# EAGLE design coprocessor (EAGLE 7.7.0)
CREVISION: 0.2; DESIGNER: Matthew Carlson

## Sheet 1 of 2
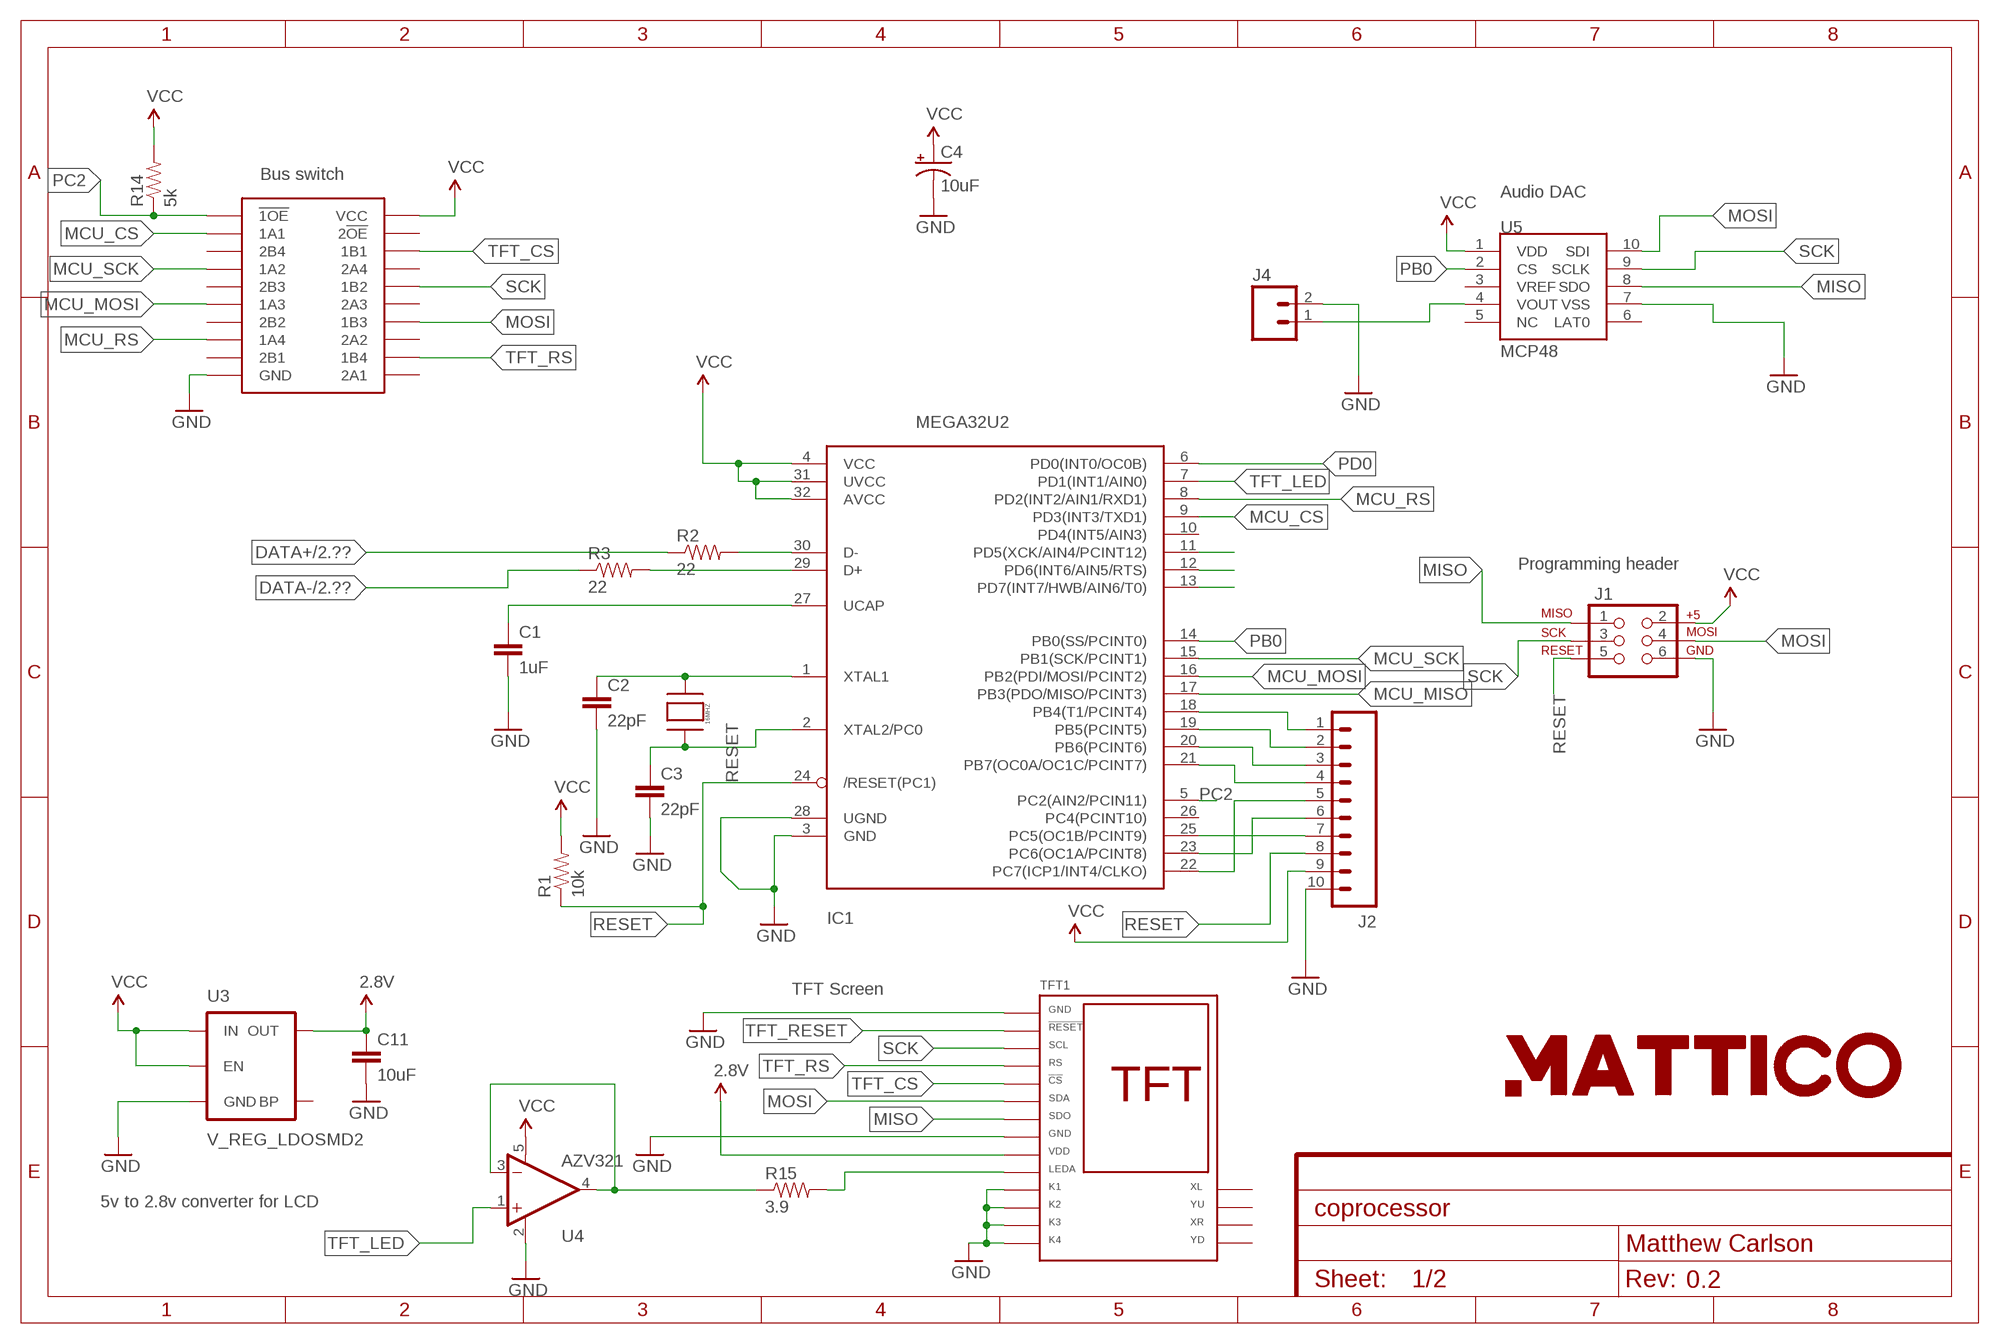
[diagram p0: schematic, sheet 1]

### Parts
C1  1uF  CAP0805  [0805]
C2  22pF  CAP0805  [0805]
C3  22pF  CAP0805  [0805]
C4  10uF  CAP_POL1206  [EIA3216]
C11  10uF  10UF10V10%(0805)  [0805-CAP]
IC1  MEGA32U2  ATMEGA32U2-TQFP  [TQFP32-08]
J1  AVR_SPI_PRG_6NS  [2X3-NS]
J2  M102MM  [1X10-2MM]
J4  M02LOCK  [1X02_LOCK]
R1  10k  RESISTOR0805-RES  [0805]
R2  22  RESISTOR0805-RES  [0805]
R3  22  RESISTOR0805-RES  [0805]
R14  5k  RESISTOR0805-RES  [0805]
R15  3.9  RESISTOR0805-RES  [0805]
TFT1  TFT-18-1.0MM  [TFT-CONN-18]
U3  V_REG_LDOSMD2  [SC70]
U4  AZV321  [SOT23-5]
U5  MCP48  MCP48FEB01-E/UN  [10-MSOP]
U6  16MHZ  CRYSTAL-ABLS  [HC49/US]
U7  CBT3244AD  [S020-75MM]
U$2  LOGO2INCH_SVG  [LOGO_2INCH_SVG]

### Nets
2.8V: C11.1 TFT1.9(VDD) U3.5(OUT)
DAC_VOUT: J4.1 U5.4(VOUT)
DATA+: R2.1 ; also sheet 2
DATA-: R3.1 ; also sheet 2
GND: C1.2 C2.2 C3.2 C4.C(-) C11.2 IC1.3(GND) IC1.28(UGND) J1.6 J2.10 J4.2 TFT1.1(GND) TFT1.8(GND) TFT1.11(K1) TFT1.12(K2) TFT1.13(K3) TFT1.14(K4) U3.2(GND) U4.2(V-) U5.7(VSS) U7.P$10(GND) ; also sheet 2
MCU_CS: IC1.9(PD3(INT3/TXD1)) U7.P$2(1A1)
MCU_MISO: IC1.17(PB3(PDO/MISO/PCINT3))
MCU_MOSI: IC1.16(PB2(PDI/MOSI/PCINT2)) U7.P$6(1A3)
MCU_RS: IC1.8(PD2(INT2/AIN1/RXD1)) U7.P$8(1A4)
MCU_SCK: IC1.15(PB1(SCK/PCINT1)) U7.P$4(1A2)
MISO: J1.1 TFT1.7(SDO) U5.8(SDO)
MOSI: J1.4 TFT1.6(SDA) U5.10(SDI) U7.P$14(1B3)
N$2: IC1.29(D+) R3.2
N$3: IC1.30(D-) R2.2
N$5: IC1.18(PB4(T1/PCINT4)) J2.1
N$7: C1.1 IC1.27(UCAP)
N$9: C2.1 IC1.1(XTAL1) U6.P$2
N$10: C3.1 IC1.2(XTAL2/PC0) U6.P$1
N$19: R15.2 TFT1.10(LEDA)
N$20: R15.1 U4.3(-IN) U4.4(OUT)
N$25: IC1.19(PB5(PCINT5)) J2.2
N$26: IC1.20(PB6(PCINT6)) J2.3
N$27: IC1.21(PB7(OC0A/OC1C/PCINT7)) J2.4
N$28: IC1.22(PC7(ICP1/INT4/CLKO)) J2.5
N$29: IC1.23(PC6(OC1A/PCINT8)) J2.6
N$30: IC1.25(PC5(OC1B/PCINT9)) J2.7
PB0: IC1.14(PB0(SS/PCINT0)) U5.2(CS)
PC2: IC1.5(PC2(AIN2/PCIN11)) R14.1 U7.P$1(!1OE)
PD0: IC1.6(PD0(INT0/OC0B))
PD5: IC1.11(PD5(XCK/AIN4/PCINT12))
PD6: IC1.12(PD6(INT6/AIN5/RTS))
PD7: IC1.13(PD7(INT7/HWB/AIN6/T0))
RESET: IC1.24(/RESET(PC1)) J1.5 J2.8 R1.1
SCK: J1.3 TFT1.3(SCL) U5.9(SCLK) U7.P$16(1B2)
TFT_CS: TFT1.5(!CS) U7.P$18(1B1)
TFT_LED: IC1.7(PD1(INT1/AIN0)) U4.1(+IN)
TFT_RESET: TFT1.2(!RESET)
TFT_RS: TFT1.4(RS) U7.P$12(1B4)
VCC: C4.A(+) IC1.4(VCC) IC1.31(UVCC) IC1.32(AVCC) J1.2 J2.9 R1.2 R14.2 U3.1(IN) U3.3(EN) U4.5(V+) U5.1(VDD) U7.P$20(VCC) ; also sheet 2
Unconnected: IC1.10(PD4(INT5/AIN3)) IC1.26(PC4(PCINT10)) TFT1.15(XL) TFT1.16(YU) TFT1.17(XR) TFT1.18(YD) U3.4(BP) U5.3(VREF) U5.5(NC) U5.6(LAT0) U7.P$3(2B4) U7.P$5(2B3) U7.P$7(2B2) U7.P$9(2B1) U7.P$11(2A1) U7.P$13(2A2) U7.P$15(2A3) U7.P$17(2A4) U7.P$19(2!OE)

### Notes on the sheet
- Bus switch
- Audio DAC
- Programming header
- TFT Screen
- 5v to 2.8v converter for LCD

## Sheet 2 of 2
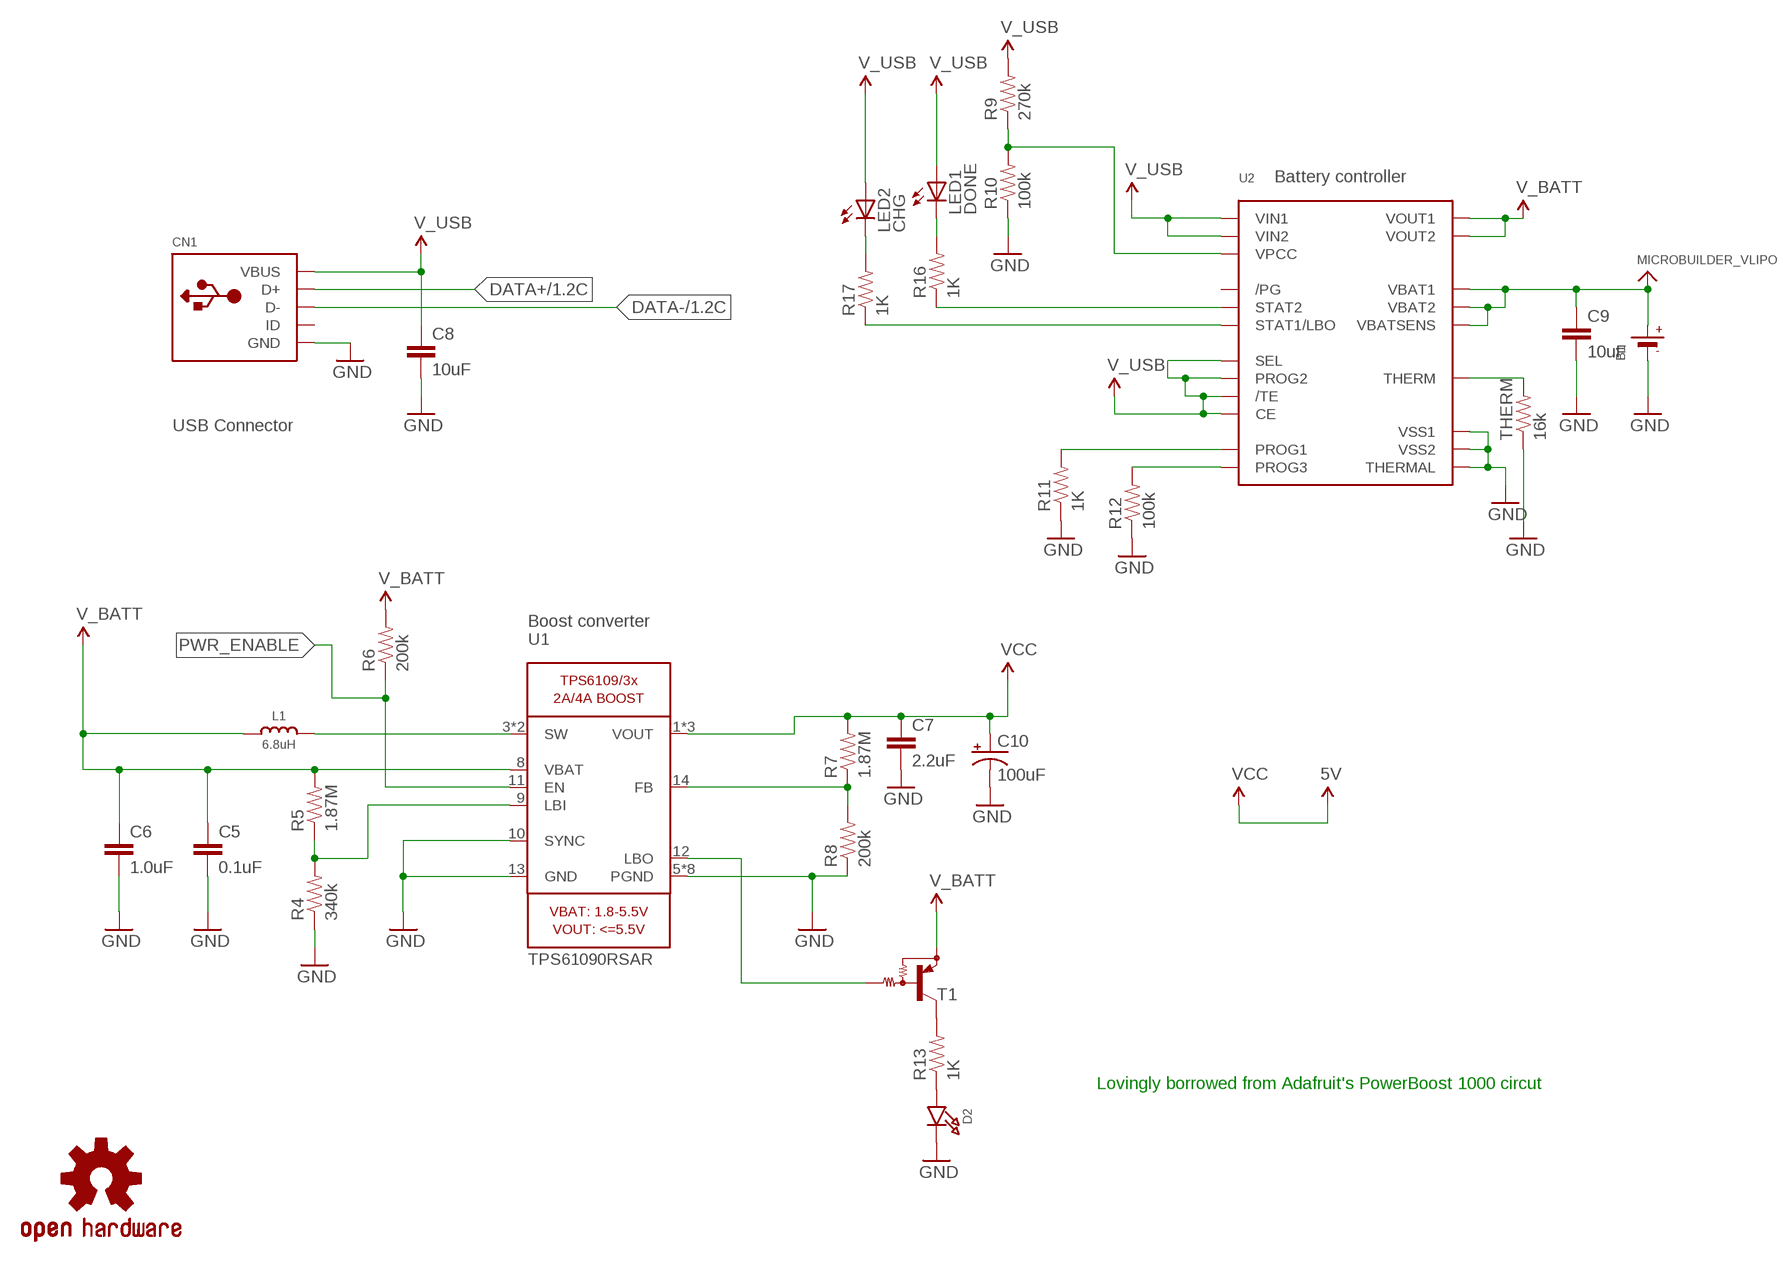
[diagram p1: schematic, sheet 2]

### Parts
B1  MICROBUILDER_BATTERY  [MICROBUILDER_JSTPH2]
C5  0.1uF  0.1UF-100V-10%(0603)  [0603-CAP]
C6  1.0uF  1.0UF-16V-10%(0603)  [0603-CAP]
C7  2.2uF  2.2UF-10V-20%(0603)  [0603-CAP]
C8  10uF  10UF-6.3V-20%(0603)  [0603-CAP]
C9  10uF  10UF-6.3V-20%(0603)  [0603-CAP]
C10  100uF  CAP_POL1206  [EIA3216]
CN1  USBMINIB  [USB-MINIB]
D2  MICROBUILDER_LED0603  [MICROBUILDER_CHIPLED_0603]
L1  6.8uH  MICROBUILDER_INDUCTOR4.9X4.9MM  [MICROBUILDER_INDUCTOR_4.9X4.9MM]
LED1  DONE  LEDCHIPLED_0603  [CHIPLED_0603]
LED2  CHG  LEDCHIPLED_0603  [CHIPLED_0603]
LOGO1  OSHW-LOGOS  [OSHW-LOGO-S]
R4  340k  340OHM-1/10W-1%(0603)  [0603-RES]
R5  1.87M  1.8KOHM1/10W1%(0603)  [0603-RES]
R6  200k  200KOHM1/10W1%(0603)200K  [0603-RES]
R7  1.87M  1.8KOHM1/10W1%(0603)  [0603-RES]
R8  200k  200KOHM1/10W1%(0603)200K  [0603-RES]
R9  270k  220KOHM1/10W1%(0603)  [0603-RES]
R10  100k  100KOHM-1/10W-1%(0603)  [0603-RES]
R11  1K  1KOHM-1/10W-1%(0603)  [0603-RES]
R12  100k  100KOHM-1/10W-1%(0603)  [0603-RES]
R13  1K  1KOHM-1/10W-1%(0603)  [0603-RES]
R16  1K  1KOHM-1/10W-1%(0603)  [0603-RES]
R17  1K  1KOHM-1/10W-1%(0603)  [0603-RES]
T1  TRANSISTOR_PNP_DRIVERMUN2111T1SC59-BEC  [TRANSISTOR_SC59-BEC]
THERM  16k  RESISTOR0603-RES  [0603-RES]
U1  TPS61090RSAR  TPS6103X  [MICROBUILDER_PVQFN-16]
U2  MCP73871  [MICROBUILDER_QFN20_4MM]

### Nets
DATA+: CN1.D+ ; also sheet 1
DATA-: CN1.D- ; also sheet 1
GND: B1.1(-) C5.2 C6.2 C7.2 C8.2 C9.2 C10.C(-) CN1.GND D2.C R4.1 R8.1 R10.1 R11.1 R12.1 THERM.1 U1.5(PGND) U1.6(PGND) U1.7(PGND) U1.10(SYNC) U1.13(GND) U1.P$18(PGND) U1.P$19(PGND) U1.P$20(PGND) U1.P$21(PGND) U1.P$22(PGND) U2.P$10(VSS1) U2.P$11(VSS2) U2.P$21(THERMAL) ; also sheet 1
N$1: R9.1 R10.2 U2.P$2(VPCC)
N$6: R4.2 R5.1 U1.9(LBI)
N$11: L1.P$2 U1.3(SW) U1.4(SW)
N$12: R11.2 U2.P$13(PROG1)
N$13: R7.1 R8.2 U1.14(FB)
N$14: R12.2 U2.P$12(PROG3)
N$15: T1.B U1.12(LBO)
N$16: R13.2 T1.C
N$17: D2.A R13.1
N$18: R16.1 U2.P$7(STAT2)
N$21: R17.1 U2.P$8(STAT1/LBO)
N$22: LED1.C R16.2
N$23: LED2.C R17.2
N$24: THERM.2 U2.P$5(THERM)
PWR_ENABLE: R6.1 U1.11(EN)
V_BATT: C5.1 C6.1 L1.P$1 R5.2 R6.2 T1.E U1.8(VBAT) U2.P$1(VOUT1) U2.P$20(VOUT2)
V_USB: C8.1 CN1.VBUS LED1.A LED2.A R9.2 U2.P$3(SEL) U2.P$4(PROG2) U2.P$9(/TE) U2.P$17(CE) U2.P$18(VIN1) U2.P$19(VIN2)
VCC: C7.1 C10.A(+) R7.2 U1.1(VOUT) U1.15(VOUT) U1.16(VOUT) ; supply symbol labelled 5V ; also sheet 1
VLIPO: B1.2(+) C9.1 U2.P$14(VBAT1) U2.P$15(VBAT2) U2.P$16(VBATSENS) ; supply symbol labelled MICROBUILDER_VLIPO
Unconnected: CN1.ID U2.P$6(/PG)

### Notes on the sheet
- Battery controller
- USB Connector
- Boost converter
- Lovingly borrowed from Adafruit's PowerBoost 1000 circut

## Library data of the parts
B1 = custom:MICROBUILDER_BATTERY: CR1220 SMT - Digikey: 3001K-ND CD2032 BAT-HLD-001 - Digikey: BAT-HLD-001-ND
C1-C3 = SparkFun-Capacitors:CAP: Capacitor Standard 0603 ceramic capacitor, and 0.1" leaded capacitor.
C4 C10 = SparkFun-Capacitors:CAP_POL: Capacitor Polarized These are standard SMD and PTH capacitors. Normally 10uF, 47uF, and 100uF in electrolytic and tantalum varieties. Always verify the external diameter of the through hole cap, it varies with capacity, voltage, and manufacturer. The EIA devices should be standard.
C5 = SparkFun-Capacitors:0.1UF-100V-10%(0603): CAP-08390; PROD_ID: CAP-08390
C6 = SparkFun-Capacitors:1.0UF-16V-10%(0603): CAP-00868; PROD_ID: CAP-00868
C7 = SparkFun-Capacitors:2.2UF-10V-20%(0603): CAP-07888; PROD_ID: CAP-07888
C8 C9 = SparkFun-Capacitors:10UF-6.3V-20%(0603): CAP-11015; PROD_ID: CAP-11015
C11 = SparkFun-Capacitors:10UF10V10%(0805): CAP-11330; PROD_ID: CAP-11330
CN1 = adafruit:USB: USB Connectors USBMINIB - Surface Mount Female Mini-B USB Connector 4UConnector: 06564 By microbuilder.eu Thru-hole RA Female Mini-B USB Connector 4UConnector: 18732 By ladyada.net
D2 = custom:MICROBUILDER_LED: LED 0603 - 0603 Surface Mount Package 2mA: Green LED - Low Power (3.9mcd, 2ma, 1.7Vf) - Digikey: 475-2709-2-ND Orange LED - Low Power (9.8mcd, 2ma, 1.8Vf) - Digikey: 475-1194-2-ND Red LED - Low Power (5mcd, 2ma, 1.8Vf) - Digikey: 475-1195-2-ND Yellow LED - Low Power (7mcd, 2ma, 1.8Vf) - Digikey: 475-1196-2-ND 5mA: Blue LED - Low Power (17mcd, 5ma, 2.9Vf) - Digikey: LNJ937W8CRACT-ND 0805 - 0805 Surface Mount Package 2mA: Red LED (8.8mcd, 2mA, 1.8Vf, Clear) - Low Power [Digikey: 475-2510-1-ND] Green LED (5mcd, 2mA, 1.8Vf, Clear) - Low Power [Digikey: 475-2730-1-ND] Yellow LED (11.3mcd, 2mA, 1.8Vf, Clear) - Low Power [Digikey: 475-2555-1-ND] 20mA: Red LED (104mcd, 20mA, Diffused) - LS R976 [Digikey: 475-1278-6-ND] Red LED (12mcd, 20mA, 2.0Vf, Clear) - APT2012EC [Digikey: 754-1128-1-ND] Green LED (15mcd, 20mA, 2.2Vf, Clear) - APT2012GC [Digikey: 754-1131-1-ND] Orange LED (160mcd, 20mA, 2.1Vf, Clear) - APT2012SECK [Digikey: 754-1130-1-ND] 1206 - 1206 Surface Mount Package Green LED (26mcd, 20mA, Diffused) - LG N971 [Digikey: 475-1407-6-ND] Red LED (15mcd, 20mA, Diffused) - LH N974 [Digikey: 475-1416-6-ND] Cree - Cree High-Power Surface Mount LEDs XPEBWT-L1-0000-00D50 - White 111lm 350mA 2.9Vf 6200K 110° XTEAWT-00-0000-00000LEE3 - White 114lm 350mA 2.85Vf 5000K 115° Everlight - Everlight 45-21 Series Surface Mount LEDs 45-21/QK2C-B2832AC2CB2/2T - Warm White 2000mcd 20mA 3.25Vf 3050K 120° 45-21/LK2C-B38452C4CB2/2T - Nuetral White 2000mcd 20mA 3.25Vf 4150K 120° 45-21/LK2C-B50634C6CB2/2T - Cold White 2200mcd 20mA 3.25Vf 5650K 120° PLCC2 Reverse Mount LS T77K-J1L2-1-0-2-R18-Z - Red 11.25mcd 2mA 1.8Vf 630nm 120° LO T77K-L1M2-24-Z - Orange 19.6mcd 2mA 1.8Vf 606nm 120° LY T77K-K2M1-26-Z - Yellow 15.7mcd 2mA 1.8Vf 587nm 120°
IC1 = adafruit:ATMEGA32U2: ATmega32u2 Pin compatible with the atmega8u2, atmega16u2 and atmega32u2 8, 16 or 32 K flash, 1K RAM, 512b EEPROM 8 bit and 16 bit timer (5 PWM total) UART, SPI (no I2C!) USB with 4 endpoints, LUFA compatible 22 I/O lines, analog comparator (no ADC!) Comes with DFU bootloader burned in!
J1 = SparkFun-Connectors:AVR_SPI_PRG_6: AVR ISP 6 Pin This is the reduced ISP connector for AVR programming. Common on Arduino. This footprint will take up less PCB space and can be used with a 10-pin to 6-pin adapter such as SKU: BOB-08508 **Special note about "TEST_POINT" package. The stop mask is on the top side, so if you want your programming test points to be on the bottom of your board, make sure to place this package on the bottom side of the board. This also ensure that the orientation to program from the bottom side will be correct.
J2 = SparkFun-Connectors:M10: Header 10 Standard 10-pin 0.1" header. Use with straight break away headers (SKU : PRT-00116), right angle break away headers (PRT-00553), swiss pins (PRT-00743), machine pins (PRT-00117), and female headers (PRT-00115).
J4 = SparkFun-Connectors:M02: Standard 2-pin 0.1" header. Use with - straight break away headers ( PRT-00116) - right angle break away headers (PRT-00553) - swiss pins (PRT-00743) - machine pins (PRT-00117) - female headers (PRT-00115) Molex polarized connector foot print use with: PRT-08233 with associated crimp pins and housings. 2.54_SCREWTERM for use with PRT-10571. 3.5mm Screw Terminal footprints for PRT-08084 5mm Screw Terminal footprints for use with PRT-08432
L1 = custom:MICROBUILDER_INDUCTOR: Inductors 0603: 10nH Ceramic Inductor - microwire antenna/RF (Digikey: 712-1434-2-ND) 0805: 560nH Ceramic Inductor - RF (Digikey: 553-1047-1-ND) 270nH Ceramic Inductor - Q = 40@250MHz, +-5%, 1 Ohm DC Resistance (Digikey: 535-10506-2-ND) 1007 (2518 Metric) SMT: 10µH 10% 250mOhm 820mA 1007 Inductor (Digikey: 587-2189-1-ND) 22µH 10% 500mOhm 580mA 1007 Inductor (Digikey: 587-2190-1-ND) 47µH 10% 950mOhm 420mA 1007 Inductor (Digikey: 587-2191-1-ND) 47µH 5% 100mOhm 1A 1008 Inductor (Digikey: 732-1816-1-ND) 5.0x5.0mm (Taiyo Yuden NR5040 Series) 6.8µH 20% 2.3A 64mOhm Inductor (Digikey: 587-2374-2-ND) 5.0x5.0mm (TDK VLC5045 Series) 4.7µH 20% 3.3A 34mOhm Inductor (Digikey: 445-6526-1-ND) 6.8µH 20% 2.7A 46mOhm Inductor (Digikey: 445-6527-1-ND) 6.0x6.0mm (TDK VLC6045 Series) 4.7µH 20% 3.8A 27mOhm Inductor (Digikey: 445-6538-2-ND) 6.8µH 20% 3A 41mOhm Inductor (Digikey: 445-6540-1-ND) 6.2µH 30% 2.2A 45mOhm Inductor (Digikey: SRR5028-6R2YCT-ND) - Not TDK VLC6045 but footprint should match 6.0x6.0mm (TDK SLF6045 Series) 6.8uH 30% 2A 33mOhm Inductor (Digikey: 445-4572-1-ND, Mouser: 810-SLF645T6R8N2R0PF) 6.0x6.0mm (Sumida CDRH5D28 Series) 6.2uH 30% 1.8A 45mOhm Inductor (Digikey: 308-1542-1-ND) Taiyo Yuden NR3015T2R2M - 2.2uH 20% 1.5A (Digikey: 587-1648-2-ND, Mouser: 963-NR3015T2R2M) - Used with TI TPS62172 CoilCraft RFID Transponder Coil - MA5532-AE (For use with AS3935 Lightning Sensor) Vishay IHLP 1.0uH Molded Inductor - 24mOhm DCR, 5A, +/-20%, -55°C-125°C (Digikey: 541-1319-1-ND)
LED1 LED2 = adafruit:LED: LED OSRAM: - CHIPLED LG R971, LG N971, LY N971, LG Q971, LY Q971, LO R971, LY R971 LH N974, LH R974 LS Q976, LO Q976, LY Q976 LO Q996 - Hyper CHIPLED LW Q18S LB Q993, LB Q99A, LB R99A - SideLED LS A670, LO A670, LY A670, LG A670, LP A670 LB A673, LV A673, LT A673, LW A673 LH A674 LY A675 LS A676, LA A676, LO A676, LY A676, LW A676 LS A679, LY A679, LG A679 - Hyper Micro SIDELED® LS Y876, LA Y876, LO Y876, LY Y876 LT Y87S - SmartLED LW L88C, LW L88S LB L89C, LB L89S, LG L890 LS L89K, LO L89K, LY L89K LS L896, LA L896, LO L896, LY L896 - TOPLED LS T670, LO T670, LY T670, LG T670, LP T670 LSG T670, LSP T670, LSY T670, LOP T670, LYG T670 LG T671, LOG T671, LSG T671 LB T673, LV T673, LT T673, LW T673 LH T674 LS T676, LA T676, LO T676, LY T676, LB T676, LH T676, LSB T676, LW T676 LB T67C, LV T67C, LT T67C, LS T67K, LO T67K, LY T67K, LW E67C LS E67B, LA E67B, LO E67B, LY E67B, LB E67C, LV E67C, LT E67C LW T67C LS T679, LY T679, LG T679 LS T770, LO T770, LY T770, LG T770, LP T770 LB T773, LV T773, LT T773, LW T773 LH T774 LS E675, LA E675, LY E675, LS T675 LS T776, LA T776, LO T776, LY T776, LB T776 LHGB T686 LT T68C, LB T68C - Hyper Mini TOPLED® LB M676 - Mini TOPLED Santana® LG M470 LS M47K, LO M47K, LY M47K Source: http://www.osram.convergy.de/
LOGO1 = SparkFun-Aesthetics:OSHW-LOGO: Open Source Hardware Logo This logo indicates the piece of hardware it is found on incorporates a OSHW license and/or adheres to the definition of open source hardware found here: http://freedomdefined.org/OSHW
R1-R3 R14 R15 THERM = SparkFun-Resistors:RESISTOR: Resistor Basic schematic elements and footprints for 0603, 1206, and PTH resistors.
R4 = SparkFun-Resistors:340OHM-1/10W-1%(0603): RES-12616; PROD_ID: RES-12616; VALUE: 340
R5 R7 = SparkFun-Resistors:1.8KOHM1/10W1%(0603): RES-09119; PROD_ID: RES-09119; VALUE: 1.8k
R6 R8 = SparkFun-Resistors:200KOHM1/10W1%(0603): RES-09385; PROD_ID: RES-09385
R9 = SparkFun-Resistors:220KOHM1/10W1%(0603): RES-08969; PROD_ID: RES-08969; VALUE: 220k
R10 R12 = SparkFun-Resistors:100KOHM-1/10W-1%(0603): RES-07828; PROD_ID: RES-07828
R11 R13 R16 R17 = SparkFun-Resistors:1KOHM-1/10W-1%(0603): RES-07856; PROD_ID: RES-07856
T1 = custom:TRANSISTOR_PNP_DRIVER: PNP Bias Resistor Transistor
TFT1 = custom:TFT-18-1.0MM
U1 = custom:TPS6103X: TPS6103x 4A Boost - 1.8-5.5V Input, Adjustable Output to 5.5V
U2 = custom:MCP73871: MCP73871 Lithium Polymer Battery Charger Digikey: MCP73871-2CCI/ML-ND
U3 = SparkFun-PowerIC:V_REG_LDO: Voltage Regulator LDO Standard 150mA LDO voltage regulator in SOT-23 layout. Micrel part MIC5205. BP (by-pass) pin is used to lower output noise with 470pF cap.; PROD_ID: VREG-08428
U4 = custom:AZV321
U5 = custom:MCP48FEB01-E
U6 = custom:CRYSTAL-ABLS: Crystal such as digikey part number 535-13436-1-ND
U7 = custom:CBT3244AD: The CBT3244A provides eight bits of high-speed TTL-compatible bus switching in a standard '244 device pinout. The low ON-state resistance of the switch allows connections to be made with minimal propagation delay. The CBT3244A device is organized as two 4-bit low-impedance switches with separate output-enable (OE) inputs. When OE is LOW, the switch is on and data can flow from port A to port B, or vice versa. When OE is HIGH, the switch is open and high-impedance state exists between the two ports. The CBT3244A is characterized for operation from −40 °C to +85 °C.
U$2 = custom:LOGO

## Net classes
0 default: clearance 0.205 mm

## Board
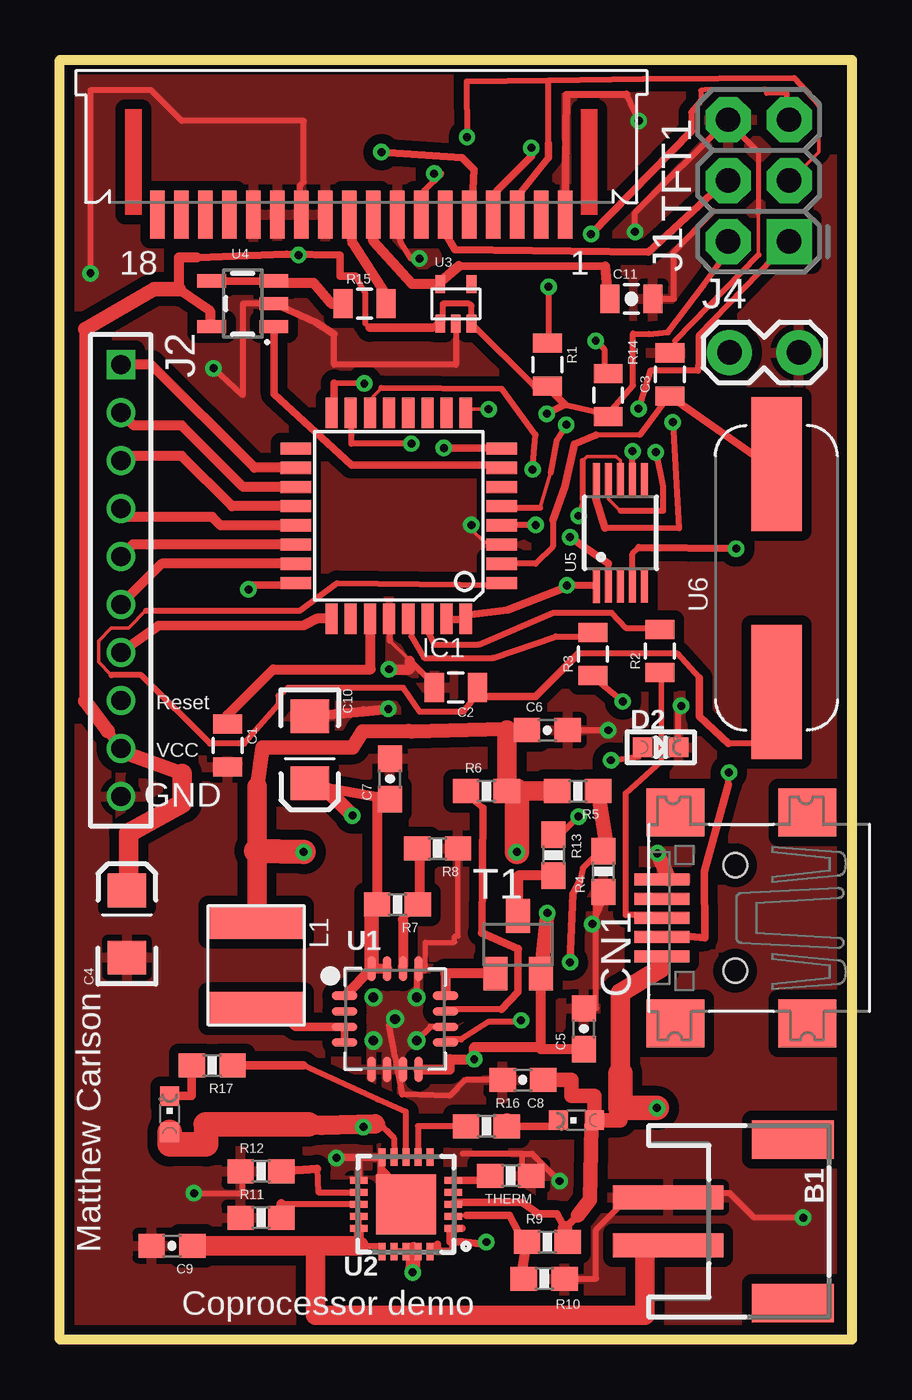
[diagram p2: board, top side]
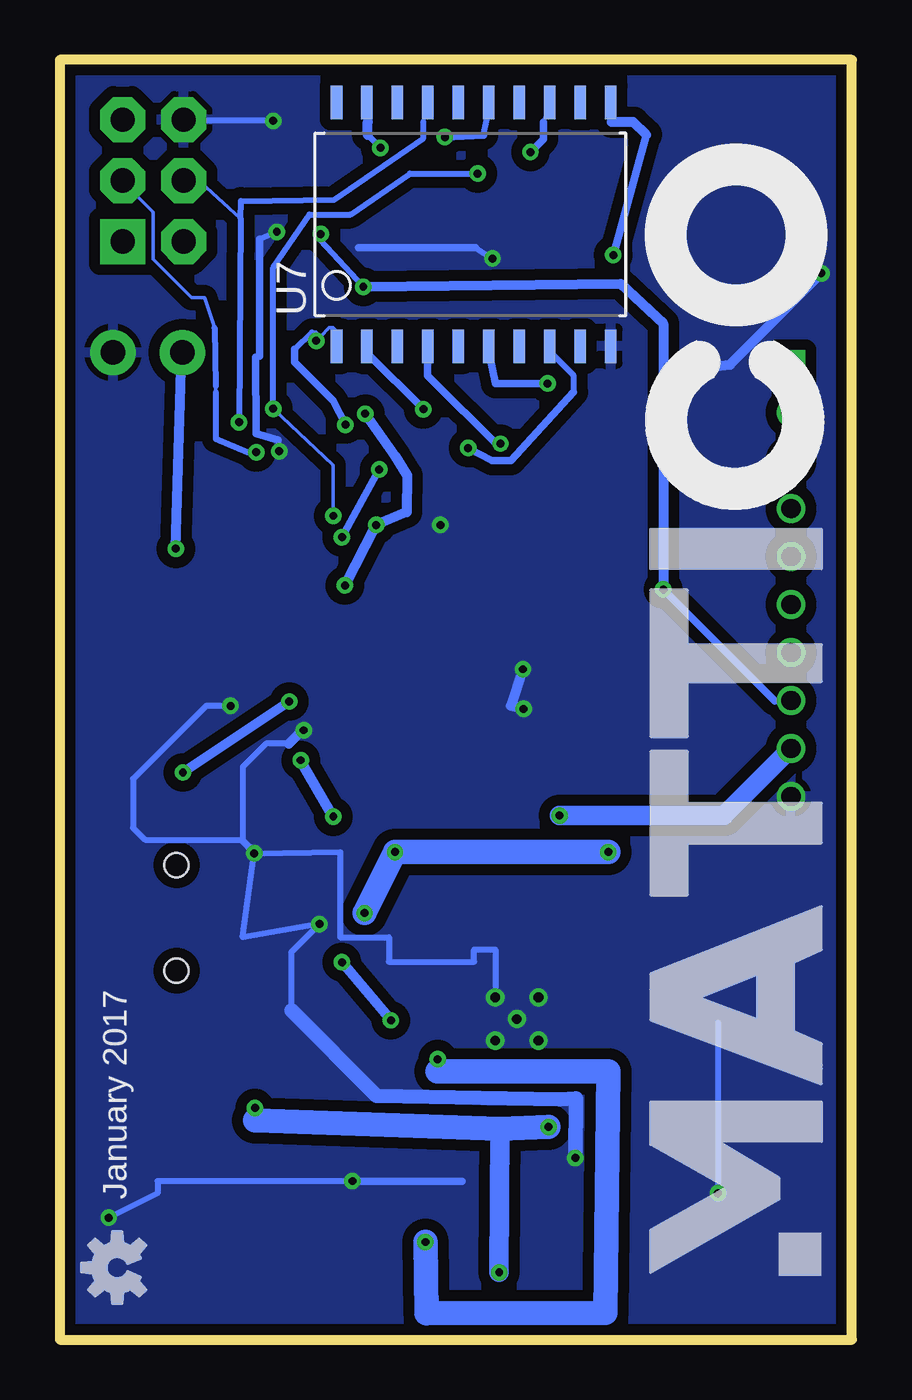
[diagram p3: board, bottom side, seen from below]

Size 33.02 x 53.34 mm. Coordinates in mm from the lower left corner, seen from the top.
Outline: 0,0 0,53.34 33.02,53.34 33.02,0 0,0
Copper layers (1*16): Top 0.0356mm / dielectric 1.5011mm / Bottom 0.0356mm
Design rules "oshpark-2layer": minimum track width 6mil, minimum drill 13mil, track to track 6mil, track to pad 6mil, pad to pad 6mil, via to via 6mil, smd to smd 6mil, copper to edge 15mil, drill to drill 6mil, minimum pad ring 7mil, minimum via ring 7mil, stop-mask expansion 2.5mil, vias tented up to drill 0mil, thermal gap 10mil

### Footprints (pad centres in the part's own frame; a part is rotated, then mirrored left to right if it is on the bottom)
MICROBUILDER_JSTPH2 = smd 1 x 4.6: 1 -1,-3.7; 2 1,-3.7 | smd 1.6 x 3.4: NC1 -3.4,1.5; NC2 3.4,1.5
0805 = smd 0.8 x 1.2: 1 -0.9,0; 2 0.9,0
EIA3216 = smd 1.4 x 1.6: A 1.4,0; C -1.4,0
0603-CAP = smd 1.1 x 1: 1 -0.85,0; 2 0.85,0
0805-CAP = smd 0.8 x 1.2: 1 -0.9,0; 2 0.9,0
USB-MINIB = smd 0.5 x 2.308: D+ 0,4.064; D- -0.8,4.064; GND 1.6,4.064; ID 0.8,4.064; VBUS -1.6,4.064 | smd 2 x 2.4: GND1 -4.4,-2; GND2 -4.4,3.5; GND3 4.4,3.5; GND4 4.4,-2 | hole 1: -2.2,1; 2.2,1
MICROBUILDER_CHIPLED_0603 = smd 0.8 x 0.8: A 0,-0.75; C 0,0.75
TQFP32-08 = smd 1.27 x 0.508: 1 -4.293,2.8; 2 -4.293,2; 3 -4.293,1.2; 4 -4.293,0.4; 5 -4.293,-0.4; 6 -4.293,-1.2; 7 -4.293,-2; 8 -4.293,-2.8; 17 4.293,-2.8; 18 4.293,-2; 19 4.293,-1.2; 20 4.293,-0.4; 21 4.293,0.4; 22 4.293,1.2; 23 4.293,2; 24 4.293,2.8 | smd 0.508 x 1.27: 9 -2.8,-4.293; 10 -2,-4.293; 11 -1.2,-4.293; 12 -0.4,-4.293; 13 0.4,-4.293; 14 1.2,-4.293; 15 2,-4.293; 16 2.8,-4.293; 25 2.8,4.293; 26 2,4.293; 27 1.2,4.293; 28 0.4,4.293; 29 -0.4,4.293; 30 -1.2,4.293; 31 -2,4.293; 32 -2.8,4.293
2X3-NS = drill 1.016 pad 1.88 square: 1 -2.54,-1.27 | drill 1.016 pad 1.88 octagon: 2 -2.54,1.27; 3 0,-1.27; 4 0,1.27; 5 2.54,-1.27; 6 2.54,1.27
1X10-2MM = drill 0.8 square: 1 0,0 | drill 0.8: 2 2,0; 3 4,0; 4 6,0; 5 8,0; 6 10,0; 7 12,0; 8 14,0; 9 16,0; 10 18,0
1X02_LOCK = drill 1.016 pad 1.88: 1 -0.178,0; 2 2.718,0
MICROBUILDER_INDUCTOR_4.9X4.9MM = smd 1.4 x 4: P$1 -1.8,0; P$2 1.8,0
CHIPLED_0603 = smd 0.8 x 0.8: A 0,-0.75; C 0,0.75
0603-RES = smd 1.1 x 1: 1 -0.85,0; 2 0.85,0
TRANSISTOR_SC59-BEC = smd 1 x 1.4: B -0.95,-1.2; C 0,1.2; E 0.95,-1.2
TFT-CONN-18 = smd 0.6 x 2: 1 -9,2; 2 -8,2; 3 -7,2; 4 -6,2; 5 -5,2; 6 -4,2; 7 -3,2; 8 -2,2; 9 -1,2; 10 0,2; 11 1,2; 12 2,2; 13 3,2; 14 4,2; 15 5,2; 16 6,2; 17 7,2; 18 8,2
MICROBUILDER_PVQFN-16 = smd 1.05 x 0.35: 1 -2.1,0.975; 2 -2.1,0.325; 3 -2.1,-0.325; 4 -2.1,-0.975; 9 2.1,-0.975; 10 2.1,-0.325; 11 2.1,0.325; 12 2.1,0.975 | smd 0.35 x 1.05: 5 -0.975,-2.1; 6 -0.325,-2.1; 7 0.325,-2.1; 8 0.975,-2.1; 13 0.975,2.1; 14 0.325,2.1; 15 -0.325,2.1; 16 -0.975,2.1 | drill 0.4: P$18 0,0; P$19 -0.9,0.9; P$20 0.9,0.9; P$21 0.9,-0.9; P$22 -0.9,-0.9
MICROBUILDER_QFN20_4MM = smd 0.73 x 0.28: P$1 -1.965,1; P$2 -1.965,0.5; P$3 -1.965,0; P$4 -1.965,-0.5; P$5 -1.965,-1; P$11 1.965,-1; P$12 1.965,-0.5; P$13 1.965,0; P$14 1.965,0.5; P$15 1.965,1 | smd 0.28 x 0.73: P$6 -1,-1.965; P$7 -0.5,-1.965; P$8 0,-1.965; P$9 0.5,-1.965; P$10 1,-1.965; P$16 1,1.965; P$17 0.5,1.965; P$18 0,1.965; P$19 -0.5,1.965; P$20 -1,1.965 | smd 2.5 x 2.5: P$21 0,0
SC70 = smd 0.4 x 0.75: 1 -0.65,-0.825; 2 0,-0.825; 3 0.65,-0.825; 4 0.65,0.825; 5 -0.65,0.825
SOT23-5 = smd 1.2 x 0.55: 1 -1.3,0.95; 2 -1.3,0; 3 -1.3,-0.95; 4 1.3,-0.95; 5 1.3,0.95
10-MSOP = smd 1.4 x 0.3: 1 -2.2,1; 2 -2.2,0.5; 3 -2.2,0; 4 -2.2,-0.5; 5 -2.2,-1; 6 2.2,-1; 7 2.2,-0.5; 8 2.2,0; 9 2.2,0.5; 10 2.2,1
HC49/US = smd 5.588 x 2.108: P$1 -4.75,0; P$2 4.75,0
S020-75MM = smd 1.397 x 0.483: P$1 -5.08,0; P$2 -5.08,-1.27; P$3 -5.08,-2.54; P$4 -5.08,-3.81; P$5 -5.08,-5.08; P$6 -5.08,-6.35; P$7 -5.08,-7.62; P$8 -5.08,-8.89; P$9 -5.08,-10.16; P$10 -5.08,-11.43; P$11 5.08,0; P$12 5.08,-1.27; P$13 5.08,-2.54; P$14 5.08,-3.81; P$15 5.08,-5.08; P$16 5.08,-6.35; P$17 5.08,-7.62; P$18 5.08,-8.89; P$19 5.08,-10.16; P$20 5.08,-11.43

### Placement (x,y rotation side)
B1  29.06,4.93 270 top
C1  6.99,24.77 270 top
C2  16.51,27.18 180 top
C3  25.43,40.23 90 top
C4  2.79,17.32 90 top
C5  21.84,12.95 90 top
C6  20.32,25.4 0 top
C7  13.77,23.37 90 top
C8  19.3,10.82 180 top
C9  4.67,3.91 180 top
C10  10.41,24.59 270 top
C11  23.83,43.38 0 top
CN1  29.16,17.58 90 top
D2  25.04,24.69 270 top
IC1  14.12,34.34 180 top
J1  29.13,48.31 90 top
J2  2.54,40.64 270 top
J4  28.09,41.15 0 top
L1  8.18,15.6 270 top
LED1  21.54,9.14 90 top
LED2  4.57,9.4 0 top
LOGO1  30.63,3 90 bottom
R1  20.32,40.64 270 top
R2  25.02,28.7 90 top
R3  22.23,28.57 90 top
R4  22.66,19.51 90 top
R5  21.59,22.86 180 top
R6  17.78,22.86 0 top
R7  14.07,18.14 180 top
R8  15.75,20.47 180 top
R9  20.32,4.06 0 top
R10  20.19,2.54 180 top
R11  8.38,5.08 0 top
R12  8.38,7.01 0 top
R13  20.57,20.19 270 top
R14  22.86,39.37 270 top
R15  12.7,43.18 0 top
R16  17.78,8.89 0 top
R17  6.35,11.43 180 top
T1  19.1,16.46 0 top
TFT1  12.06,48.9 180 top
THERM  18.8,6.83 180 top
U1  13.97,13.36 0 top
U2  14.43,5.64 180 top
U3  16.51,43.18 0 top
U4  7.62,43.18 180 top
U5  23.37,33.63 90 top
U6  29.87,31.75 270 top
U7  21.49,46.48 90 bottom
U$2  0.51,2.03 90 bottom

### Tracks (layer width: path | path; a pad name or v marks a point on that pad's centre or on a via)
2.8V
  Top 0.152: 15.9,44.14 U3.5
  Top 0.254: 13.06,46.65 TFT1.9 | C11.1 22.86,43.38
  Top 0.305: 16.62,44.75 22.74,44.74
  Top 0.406: U3.5 14.67,44.01 13.06,45.8 13.06,46.65 | 15.9,44.14 16.62,44.75 | 22.86,43.38 22.74,44.74
DAC_VOUT  (via drill 0.33)
  Top 0.254: U5.4 23.87,32.76 24.13,33.02
  Top 0.305: 24.13,33.02 v28.19,32.97
  Bottom 0.254: 27.94,41.12 J4.1
  Bottom 0.406: v28.19,32.97 27.94,41.12
DATA+
  Top 0.152: 23.95,17.69 25.02,17.69 CN1.D+ | 25.07,27.55 R2.1
  Top 0.229: 25.07,24.1 25.07,27.55
  Top 0.254: 25.07,24.1 23.59,22.77 23.59,17.69 23.95,17.69
DATA-  (via drill 0.33)
  Top 0.152: 26.27,16.8 25.2,16.8 CN1.D- | 22.34,27.52 R3.1
  Top 0.254: v23.46,26.6 22.34,27.52 | 27.87,23.13 v27.89,23.64
  Top 0.305: 27.87,23.13 26.86,19.52 26.88,16.75 26.27,16.8
  Bottom 0.406: v27.89,23.64 v23.46,26.6
GND  (via drill 0.33)
  Top 0.152: 15.01,15.37 U1.13 | 15.01,14.3 U1.P$20 | 25.66,41.64 25.55,41.28 C3.2 | 29.13,46.94 29.13,45.21 | 27.88,50.75 J1.6 | 10.01,46.9 10.01,47 TFT1.12 | 14.59,28.3 13.76,29.13 | 13.76,30.02 IC1.28 | 15.55,27.34 C2.2 | v17.16,33.95 17.16,33.77 17.69,33.24 18.41,33.24 IC1.3 | TFT1.13 8.94,47 8.94,46.9
  Top 0.203: 29.13,49.5 29.13,46.94 29.03,47.04 27.23,47.04 | 15.01,15.37 15.24,15.37 15.24,16.56 16.46,16.56 16.46,16.82 16.6,16.82 R8.1
  Top 0.254: U3.2 16.51,40.64 11.43,40.64 11.43,41.91 | 29.13,45.21 25.66,41.64 | 27.88,50.75 29.13,49.5 | 23.62,51.92 v24.13,50.8 | 10.01,46.9 10.01,48.11 10.16,48.26 10.16,50.8 5.08,50.8 3.81,52.07 1.27,52.07 v1.27,44.45 | U4.2 7.62,43.18 7.62,39.37 v6.4,40.49 | v14.99,45.06 14.63,45.06 14.22,45.72 13.97,46.8 TFT1.8 | C6.2 v22.86,25.4 | U5.7 23.87,36.16 v23.88,37.03 | v23.98,46.18 23.98,46.97 J1.6 | C11.2 25.6,43.38 25.6,45.34 27.23,47.04 | 13.43,5.64 13.43,7.11 | 13.43,7.11 U2.P$10 12.19,7.6 12.19,7.62 12.46,7.62 U2.P$11 | 13.76,29.13 13.76,30.02 | 15.55,27.34 14.59,28.3 | 15.01,15.37 14.87,15.37 U1.P$20 | C5.2 22.35,13.8 22.35,18.8 22.86,18.8 v22.2,17.32 | CN1.GND 25.4,19.18 | v5.59,6.1 7.62,6.1 7.62,7.11 | THERM.1 19.3,6.93 19.28,7.75 | 19.28,7.75 16.79,7.75 | 15.24,6.6 13.94,6.6 | 13.94,6.6 13.43,7.11 | R10.1 22.35,2.54 22.35,4.57 23.88,6.1 25.19,6.1 | 25.19,6.1 B1.1 | U1.10 15.45,13.04 U1.P$21 | C8.2 16.92,10.82 16.26,10.16 14.28,10.21 13.72,13.11 U1.P$18 | 19.28,7.75 19.68,7.75 v20.83,6.6 | v30.99,5.08 28.96,5.08 27.94,6.1 25.19,6.1 | D2.C 25.79,26.3 v25.91,26.42 | 13.94,6.6 13.54,6.6 13.51,6.63 13.39,6.63 13.36,6.6 13.36,6.93 13.41,6.99 13.41,7.54 13.39,7.57 v11.53,7.57
  Top 0.305: 11.43,41.91 10.67,42.42 U4.2 | TFT1.1 21.12,51.9 23.62,51.92 | 15.24,6.6 13.49,6.55 13.41,6.63 13.41,6.99 13.41,7.59 11.91,7.59
  Top 0.356: U2.P$21 13.43,5.64
  Top 0.406: C10.C 12.65,26.19 v13.69,26.29 | v13.72,27.94 14.59,27.94 14.59,28.3
  Top 0.61: 25.4,19.18 v24.92,20.27
  Bottom 0.254: v24.13,50.8 27.81,50.8 J1.6 | 15.7,45.52 v14.99,45.06 | v22.86,25.4 22.91,25.4 | v23.88,37.03 23.93,37.49 | 24.87,40.95 24.69,41 | 24.69,45.87 v23.98,46.18 | v24.92,20.27 21.34,20.32 21.34,16.76 19.3,16.76 19.3,15.75 15.75,15.75 15.75,16.26 14.87,16.26 U1.P$20 | v24.92,20.27 25.4,16.76 v22.2,17.32 23.37,16.15 23.37,13.72 | 5.59,13.21 v5.59,6.1 | v20.83,6.6 28.96,6.6 28.96,6.1 v30.99,5.08 | 23.47,24.84 24.43,24.84 25.4,23.88 25.4,20.83 24.89,20.32 | v25.91,26.42 26.92,26.42 29.97,23.37 29.97,21.34 29.46,20.83 25.48,20.83 v24.92,20.27
  Bottom 0.305: 20.57,45.52 15.7,45.52 | 23.93,37.49 24.84,37.77 24.87,40.95 | 24.69,41 24.69,45.87 | 16.26,6.6 v20.83,6.6
  Bottom 0.406: v6.4,40.49 5.08,40.64 v1.27,44.45 | 22.91,25.4 23.47,24.84 | v13.69,26.29 14.22,26.42 v13.72,27.94
  Bottom 0.61: v11.53,7.57 11.51,10.06 12.19,10.01 19.81,10.16 23.37,13.72
  pour Top (isolate 0.406): 0,53.34 33.02,53.34 33.02,0 0,0
  pour Bottom (isolate 0.457): 0,53.37 33.02,53.34 33.12,0 0,0
MCU_CS  (via drill 0.33)
  Top 0.152: v17.87,38.78 16.98,38.78 IC1.9
  Bottom 0.152: 20.19,41.1 20.19,41.82 U7.P$2
  Bottom 0.305: 20.19,41.1 v17.87,38.78
MCU_MOSI  (via drill 0.33)
  Top 0.152: 11.44,39.31 11.44,38.78 IC1.16
  Top 0.254: v12.69,39.85 11.43,39.88
  Top 0.305: 11.43,39.88 11.44,39.31
  Bottom 0.152: 15.19,41.46 15.19,41.82 U7.P$6
  Bottom 0.305: v12.69,39.85 14.85,39.85 15.19,41.46
MCU_RS  (via drill 0.33)
  Top 0.152: 18.41,37.17 IC1.8
  Top 0.305: v16,37.17 18.41,37.17
  Bottom 0.152: 12.69,41.28 12.69,41.82 U7.P$8
  Bottom 0.254: 11.62,39.49 11.62,40.21 12.69,41.28
  Bottom 0.305: v16,37.17 15.01,36.63 14.22,36.63 11.62,39.49
MCU_SCK  (via drill 0.33)
  Top 0.152: 12.15,38.06 12.15,38.6 IC1.15
  Top 0.254: 12.15,38.06 12.15,37.35 v14.65,37.35
  Bottom 0.152: 14.65,37.15 v14.65,37.35 | 17.69,41.82 U7.P$4
  Bottom 0.305: 14.65,37.15 17.69,40.19 17.69,41.82
MISO  (via drill 0.33)
  Top 0.152: 21.8,36.63 21.98,36.81 23.18,36.81 23.36,36.63 23.36,35.92 U5.8 | v21.62,34.34 21.8,35.02 | 24.18,38.98 v24.12,38.8 | 30.38,45.75 J1.1 | 15.19,47.89 15.19,47 TFT1.7
  Top 0.254: 21.8,35.02 21.8,36.63 | 24.18,38.98 24.61,40.39 26.6,40.39 26.63,40.92 26.63,41.84 30.38,45.75 | 15.19,47.89 15.9,48.61 v15.6,48.61
  Bottom 0.152: v21.62,34.34 21.62,36.45 v24.12,38.8
  Bottom 0.254: v15.6,48.61 18.43,48.61 20.91,46.9 22.62,46.9 24.12,44.67 v24.12,38.8
MOSI  (via drill 0.33)
  Top 0.152: 22.34,35.02 22.34,35.74 U5.10 | 16.08,46.1 16.08,46.82 TFT1.6 | 27.7,48.25 J1.4
  Top 0.254: 22.72,33.83 24.94,33.83 25.81,33.81 v25.55,38.24
  Top 0.305: 22.72,33.83 22.34,35.02 | 16.08,46.1 16.47,45.44 24.53,45.34 27.7,48.25
  Bottom 0.152: 25.48,46.72 27.16,48.25 27.7,48.25 J1.4 | 17.87,50.75 U7.P$14
  Bottom 0.254: v25.55,38.24 25.48,46.72 25.48,47.45 21.59,47.51 17.87,50.09 17.87,50.75
N$1
  Top 0.152: 16.95,5.18 U2.P$2 | 19.3,4.11 R9.1
  Top 0.254: U2.P$2
  Top 0.305: 16.95,5.18 18.73,5.18 19.3,4.11
  Top 0.406: R10.2 19.3,3.05 R9.1
N$2
  Top 0.152: 14.65,29.31 14.65,30.02 IC1.29 | 22.16,29.31 R3.2
  Top 0.254: 22.16,29.31 20.68,29.31 18.05,28.41 15.19,28.41 14.65,29.31
N$3
  Top 0.152: 15.37,29.48 15.37,30.02 IC1.30 | 25.02,29.66 R2.2
  Top 0.254: 25.02,29.66 23.59,29.66 23,30.3 20.57,30.3 17.46,28.98 15.62,28.98 15.37,29.48
N$5
  Top 0.406: IC1.18 8.11,36.34 3.81,40.64 J2.1
N$6  (via drill 0.33)
  Top 0.152: 16.08,12.51 U1.9 | 22.34,20.19 R4.2
  Top 0.254: 16.08,12.51 16.72,12.51 17.87,13.25 18.99,13.25 v19.22,13.3 | 21.67,19.12 21.8,19.66 22.34,20.19
  Top 0.305: v21.27,15.73 21.39,18.59 21.67,19.12
  Top 0.406: R4.2 22.82,20.36
  Top 0.61: 22.82,20.36 R5.1
  Bottom 0.406: v21.27,15.73 v19.22,13.3
N$7
  Top 0.406: C1.1 6.99,26.04 8.89,27.94 12.95,27.94 12.95,29.83 IC1.27
N$9
  Top 0.152: 28.95,24.84 29.84,25.73 29.84,27.16 U6.P$2 | 17.51,26.8 C2.1 17.33,26.8 | 3.57,30.38 2.86,29.66 2.14,29.66 1.61,29.13 1.61,28.23 2.14,27.7 | 18.41,31.45 IC1.1
  Top 0.254: 21.62,28.59 25.73,28.59 26.65,27.57 | 28.95,24.84 27.88,24.84 | 18.41,31.45 11.56,31.53 10.01,30.38 3.57,30.38 | 2.14,27.7 3.4,27.7 6.25,24.84 7.68,24.84 9.12,26.47 9.12,26.83 9.5,27.16 14.32,27.16 15.01,26.17 16.8,26.17 17.33,26.8
  Top 0.305: 17.51,26.8 19.84,26.8 21.62,28.59 | 26.65,27.57 26.65,25.96 27.88,24.84
N$10
  Top 0.152: 18.59,32.34 IC1.2 | 25.38,39.31 C3.1
  Top 0.203: 24.17,37.71 22.34,37.71
  Top 0.254: U6.P$1 29.71,36.32 | 18.59,32.34 19.84,32.34 20.55,33.06 20.55,34.16 | 25.38,39.31 24.17,37.71
  Top 0.305: 29.71,36.32 C3.1 | 20.55,34.16 21.06,35.56 21.44,37.32 22.34,37.71
N$11
  Top 0.152: 9.02,13.84 8.94,13.76 8.22,13.76 L1.P$2
  Top 0.254: 9.02,13.84 8.89,13.97
  Top 0.305: U1.3 U1.4
  Top 0.356: U1.3 9.82,13.04 9.02,13.84
N$12
  Top 0.254: U2.P$13 9.23,5.64
  Top 0.406: 9.23,5.64 R11.2
N$13
  Top 0.152: 14.3,15.55 U1.14 | 14.83,18.05 R7.1 15.01,18.23 | 15.01,20.37 R8.2
  Top 0.254: 14.83,18.05 14.3,17.51
  Top 0.406: 14.3,17.51 14.3,15.55 | 15.01,18.23 15.01,20.37
N$14
  Top 0.254: 10.72,7.13 10.77,6.15 12.64,6.15 U2.P$12
  Top 0.356: R12.2 10.72,7.13
N$15
  Top 0.406: T1.B 16.07,15.26 U1.12
N$16
  Top 0.406: R13.2 19.1,19.34 T1.C
N$17  (via drill 0.33)
  Top 0.152: 24.12,24.3 24.12,24.66 D2.A | 20.73,20.91 R13.1
  Top 0.254: v22.98,24.15 24.12,24.3 | 20.73,20.91 v21.62,21.8
  Bottom 0.406: v21.62,21.8 v22.98,24.15
N$18
  Top 0.254: R16.1 14.93,8.89 U2.P$7
N$19
  Top 0.254: R15.2 13.6,43.55 | 12.04,46.87 TFT1.10
  Top 0.406: 13.6,43.55 12.19,45.72 12.04,46.87
N$20
  Top 0.254: 9.01,44.04 U4.3
  Top 0.305: U4.4 U4.3
  Top 0.406: R15.1 11.33,43.18 10.59,44.04 9.01,44.04
N$21
  Top 0.254: U2.P$8 14.43,9.5 13.26,10.01 10.16,11.43
  Top 0.356: 10.16,11.43 R17.1
N$22
  Top 0.305: R16.2 20.79,8.89 LED1.C
  Top 0.61: 18.63,9.14 R16.2
N$23
  Top 0.356: LED2.C 5.5,10.15 R17.2
N$24
  Top 0.305: U2.P$5 18.2,6.64 THERM.2
N$25
  Top 0.406: IC1.19 7.64,35.54 5.08,38.1 3.08,38.1 J2.2
N$26
  Top 0.406: IC1.20 7.17,34.74 5.08,36.83 2.73,36.83 J2.3
N$27
  Top 0.406: IC1.21 6.7,33.94 6.35,34.29 2.89,34.29 J2.4
N$28
  Top 0.406: IC1.22 3.04,33.14 J2.5
N$29
  Top 0.406: IC1.23 4.24,32.34 J2.6
N$30
  Top 0.406: IC1.25 10.72,30.05 10.16,29.77 4.1,29.74 J2.7
PB0  (via drill 0.33)
  Top 0.152: 13.4,39.67 13.04,39.31 13.04,38.78 IC1.14 | 22.87,31.45 U5.2
  Top 0.254: 13.4,39.67 18.43,39.62 19.84,37.71 v19.71,36.27 | 22.87,31.45 22.87,32.34
  Top 0.305: 22.87,32.34 v21.27,33.45
  Bottom 0.305: v21.27,33.45 v19.71,36.27
PC2  (via drill 0.33)
  Top 0.152: 22.7,40.39 R14.1 | 20.45,36.12 20.01,34.67 | 18.59,34.67 IC1.5
  Top 0.254: 22.7,40.39 22.7,41.28 v22.34,41.64 | 20.01,34.67 18.59,34.67 | 20.45,36.12 20.71,37.48 v21.11,38.14
  Bottom 0.152: 22.16,41.82 21.8,42.17 21.62,42.17 21.44,41.99 U7.P$1 | 22.52,41.99 22.34,41.99 22.16,41.82 | 22.16,41.82 v22.34,41.64
  Bottom 0.254: 22.52,41.99 23.23,41.28
  Bottom 0.305: v21.11,38.14 21.62,39.13 23.23,40.74 23.23,41.28
PWR_ENABLE
  Top 0.152: 16.08,13.76 U1.11 | 16.98,22.7 R6.1
  Top 0.254: 18.41,13.76 16.08,13.76 | 16.98,22.7 17.64,22.16
  Top 0.305: 18.41,13.76 19.09,14.5 19.09,16.29 | 17.64,22.16 17.59,16.95
  Top 0.356: 17.59,16.95 19.09,16.29
RESET  (via drill 0.33)
  Top 0.152: v7.86,31.27 8.04,31.45 | 9.83,31.45 IC1.24 | 20.37,41.64 R1.1 | 30.38,50.93 J1.5
  Top 0.203: 26.72,51.64 26.72,52.08 26.91,52.1 29.38,52.13 29.46,51.95 30.3,51.94
  Top 0.254: v20.37,43.88 20.37,41.64 | 26.32,50.37 26.32,51.16 26.72,51.64 | 30.38,50.93 30.3,51.94
  Top 0.305: 8.04,31.45 9.83,31.45 | 26.32,50.37 v22.15,46.09
  Bottom 0.152: 3.22,26.63 2.68,26.63 J2.8 | v22.15,46.09 22.17,45.86
  Bottom 0.254: 22.17,45.86 v20.37,43.88
  Bottom 0.305: 3.22,26.63 v7.86,31.27
  Bottom 0.406: v7.86,31.27 7.86,42.35 9.65,44.01 v20.37,43.88
SCK  (via drill 0.33)
  Top 0.152: 19.12,47.71 19.12,47 TFT1.3 | 23.37,34.54 22.87,35.02 22.87,35.74 U5.9 | 31.63,51.47 31.63,49.5 30.56,48.43 J1.3
  Top 0.254: v16.97,50.12 16.96,52.43 20.37,52.48 | 20.37,49.86 20.37,52.48 | 23.37,34.54 25.15,34.54 25.15,35.56 v24.84,36.99 | 20.37,52.48 24.32,52.54 30.61,52.59 31.63,51.47
  Top 0.305: 20.37,49.86 20.37,49.27 19.12,47.71
  Bottom 0.152: 15.22,50.88 U7.P$16 | 25.2,36.99 v24.84,36.99 | 26.52,39.75 26.52,39.49 | 26.57,42.17 26.98,43.42 27.52,43.42 29.13,45.03 29.13,47 30.38,48.25 J1.3
  Bottom 0.254: 15.37,50.2 15.22,50.88 | 25.2,36.99 26.52,37.55 26.52,39.49 | 26.57,42.17 26.52,39.75
  Bottom 0.305: v16.97,50.12 15.37,50.2
TFT_CS  (via drill 0.33)
  Top 0.152: 17.18,47.13 17.16,47 TFT1.5
  Top 0.305: v13.4,49.5 16.76,49.28 17.27,48.77 17.18,47.13
  Bottom 0.152: 12.87,50.75 U7.P$18
  Bottom 0.305: 12.87,50.75 12.87,50.04 v13.4,49.5
TFT_LED
  Top 0.152: 8.94,42.17 U4.1 | 18.41,36.45 IC1.7
  Top 0.305: 8.94,42.17 8.94,39.42 12.15,36.45 18.41,36.45
TFT_RS  (via drill 0.33)
  Top 0.152: 19.66,49.32 v19.66,49.68 | 18.23,47.89 18.23,47 TFT1.4
  Top 0.305: 18.23,47.89 19.66,49.32
  Bottom 0.152: 20.19,50.75 U7.P$12
  Bottom 0.254: v19.66,49.68 20.19,50.22
  Bottom 0.406: 20.19,50.22 20.19,50.75
V_BATT  (via drill 0.33)
  Top 0.152: 18.59,25.45 18.63,25.4 | 8.22,17.51 L1.P$1
  Top 0.203: 14.53,25.38 14.65,25.35
  Top 0.254: 20.05,12.19 20.05,12.1
  Top 0.279: U2.P$20 15.75,3.96
  Top 0.305: 15.75,3.96 15.75,3.67 16.39,3.67 U2.P$1 16.76,4.64 16.26,4.57 16.26,4.06 16.76,4.06 17.88,3.95
  Top 0.406: R6.2 R5.2 | C6.1 18.63,25.4 | C5.1 20.05,12.1 | T1.E 20.05,12.19 17.27,12.19 v17.27,11.68 16.26,11.68 16.26,11.26 U1.8 | 17.88,3.95 v17.78,4.06
  Top 0.61: 14.65,25.35 18.59,25.45 | 14.53,25.38 12.61,25.35 12.2,24.68 8.46,24.68 8.22,23.05 | T1.E v20.32,17.78
  Top 0.813: 18.63,25.4 R6.2 | 8.22,17.51 8.22,23.05 | R5.2 19.05,22.86
  Top 1.016: 19.05,22.86 v19.05,20.32 | v10.16,20.32 8.18,20.37
  Bottom 0.406: 17.27,11.18 v17.27,11.68
  Bottom 1.016: v10.16,20.32 v19.05,20.32 v20.32,17.78 | v17.78,4.06 17.73,1.09 10.29,1.12 10.16,11.18 17.27,11.18
V_USB  (via drill 0.33)
  Top 0.152: 23.36,11.1 23.77,11.1 | 20.01,11.26 C8.1 | 25.02,15.9 CN1.VBUS | 14.83,3.75 U2.P$19 | 14.47,3.75 U2.P$18 14.47,3.57 | U2.P$4 16.44,6.08 16.44,5.72 U2.P$3 | 21.09,4.11 R9.2 | 22.16,8.94 LED1.A | 13.94,7.68 U2.P$9 | 4.65,8.55 LED2.A
  Top 0.254: U2.P$18 U2.P$17 | 9.14,8.96 v12.65,8.87 | 13.36,8.99 13.66,8.69 13.92,8.41 13.95,7.64 U2.P$9
  Top 0.305: 14.47,3.75 14.73,3.75 14.93,3.75 U2.P$19 | 16.44,5.72 19.27,5.72 19.96,5.23 20.73,5.23 21.06,4.65 21.59,5.18
  Top 0.406: 25.02,15.44 25.02,15.9 | 13.15,8.99 13.36,8.99
  Top 0.61: 23.36,9.65 23.36,9.14 LED1.A 22.29,10.16 21.34,10.16 21.34,10.82 C8.1 | 21.09,4.11 21.06,4.65 | 21.59,5.18 22.1,5.83 22.16,8.94 | 14.73,3.75 v14.71,2.79
  Top 0.813: 25.02,15.44 23.36,14.45 23.36,11.1 | 13.15,8.99 10.9,8.94 10.37,8.96
  Top 1.016: 23.36,11.1 23.36,9.65 v24.89,9.65 | 10.37,8.96 9.14,8.96 6.1,8.96 | 6.08,8.96 6.1,8.96 | 6.1,8.96 6.1,8.13 4.57,8.13 LED2.A
  Bottom 0.254: 24.89,9.14 v24.89,9.65
  Bottom 0.813: v14.71,2.79 14.68,8.79
  Bottom 1.016: v12.65,8.87 14.68,8.79 24.89,9.14
VCC  (via drill 0.33)
  Top 0.152: 16.8,30.02 IC1.32 16.98,30.2 | 18.59,33.95 IC1.4 | 22.34,31.45 U5.1 | v21.14,31.43 21.01,31.33 | 2.86,18.76 C4.A | 2.68,24.48 J2.9 2.5,24.66 | 12.92,42.17 12.74,42.35 | 6.25,42.35 U4.5 | 15.73,42.35 U3.1 | 22.7,38.6 R14.2 22.87,38.6 | 20.37,39.67 R1.2 | 9.44,45.23 v9.95,45.21 | 27.88,45.39 J1.2 | C10.A 10.37,23.23 10.37,23.13
  Top 0.203: 2.79,19.05 C4.A
  Top 0.254: J1.2 27.86,45.43 | U3.1 15.95,42.45 15.95,43.18 17.07,43.18 17.16,43.09 U3.3 19.77,39.74 R1.2 | v19.84,33.95 18.59,33.95 | 12.32,44.32 12.74,43.6 12.74,42.35 | 15.73,42.35 15.55,42.17 | 21.06,38.98 22.7,38.6 | 27.88,45.39 26.86,43.99 25.35,41.99 24.56,41.92 23.89,41.94 23.89,39.77 22.87,38.6
  Top 0.305: 16.8,30.02 16.26,30.02 IC1.31 | 22.34,31.45 v21.14,31.43 | 16.98,30.2 18.66,30.4 21.01,31.33 | 5.72,45.11 9.44,45.23 11.68,45.21 11.68,44.32 12.32,44.32 | 20.37,39.67 21.06,38.98 v20.3,38.59
  Top 0.356: 15.55,42.17 12.92,42.17
  Top 0.406: 6.25,42.35 6.25,42.89 4.96,43.78 4.96,45.11 5.72,45.11 | 1.99,25.38 2.5,24.66 | 10.16,22.86 10.16,23.13 10.37,23.13 C7.1 13.22,22.52 R7.2 12.99,18.14 | U1.15 U1.16 11.92,14.34 U1.1
  Top 0.508: 1.05,42.12 1.05,26.63
  Top 0.61: 2.68,24.48 5.1,23.59 | 1.05,26.63 1.99,25.38 | 1.05,42.12 3.93,43.78 4.96,43.78 | U1.16 12.99,17.91 R7.2 | 10.16,23.13 10.91,23.13 v12.19,21.84
  Top 0.813: 2.86,18.76 2.86,21.11 5.1,22.34 5.1,23.59
  Bottom 0.152: 10.01,50.75 U7.P$20
  Bottom 0.305: v9.95,45.21 8.58,50.22
  Bottom 0.406: v21.14,31.43 v19.84,33.95 18.57,34.49 18.54,36.02 19.05,36.83 v20.3,38.59 | 10.01,50.75 9.11,50.75 8.58,50.22
  Bottom 0.813: v12.19,21.84 5.34,21.84 J2.9
VLIPO
  Top 0.254: 12.46,3.91 13.43,3.91 U2.P$16 | B1.2 25.36,3.77 | U2.P$15 U2.P$14
  Top 0.406: 12.46,3.91 U2.P$15 | B1.2 24.38,3.93
  Top 0.813: C9.1 10.67,3.91 | 10.67,3.91 12.46,3.91 | 24.38,3.93 24.38,1.02 10.67,1.02 10.67,3.91

### Text on the board
tPlace: GND | Matthew Carlson | Coprocessor demo
bPlace: January 2017
tNames: Reset | VCC